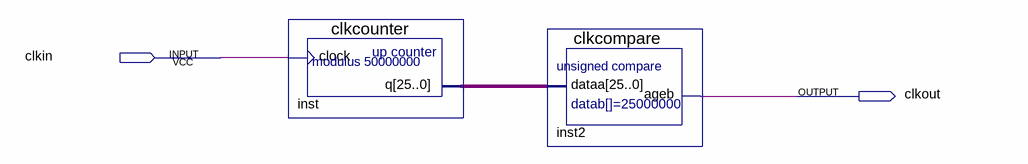
[diagram p0: schematic sheet]
// Quartus schematic clock.bdf as structural Verilog: 2 symbols, 2 pins
module clock (
  input  clkin,
  output clkout
);

  wire [25:0] inst_q;

  clkcounter inst (.clock(clkin), .q(inst_q));
  clkcompare inst2 (.dataa(inst_q), .ageb(clkout));
endmodule
